# EAGLE design rj12_adapter (EAGLE 8.5.0)
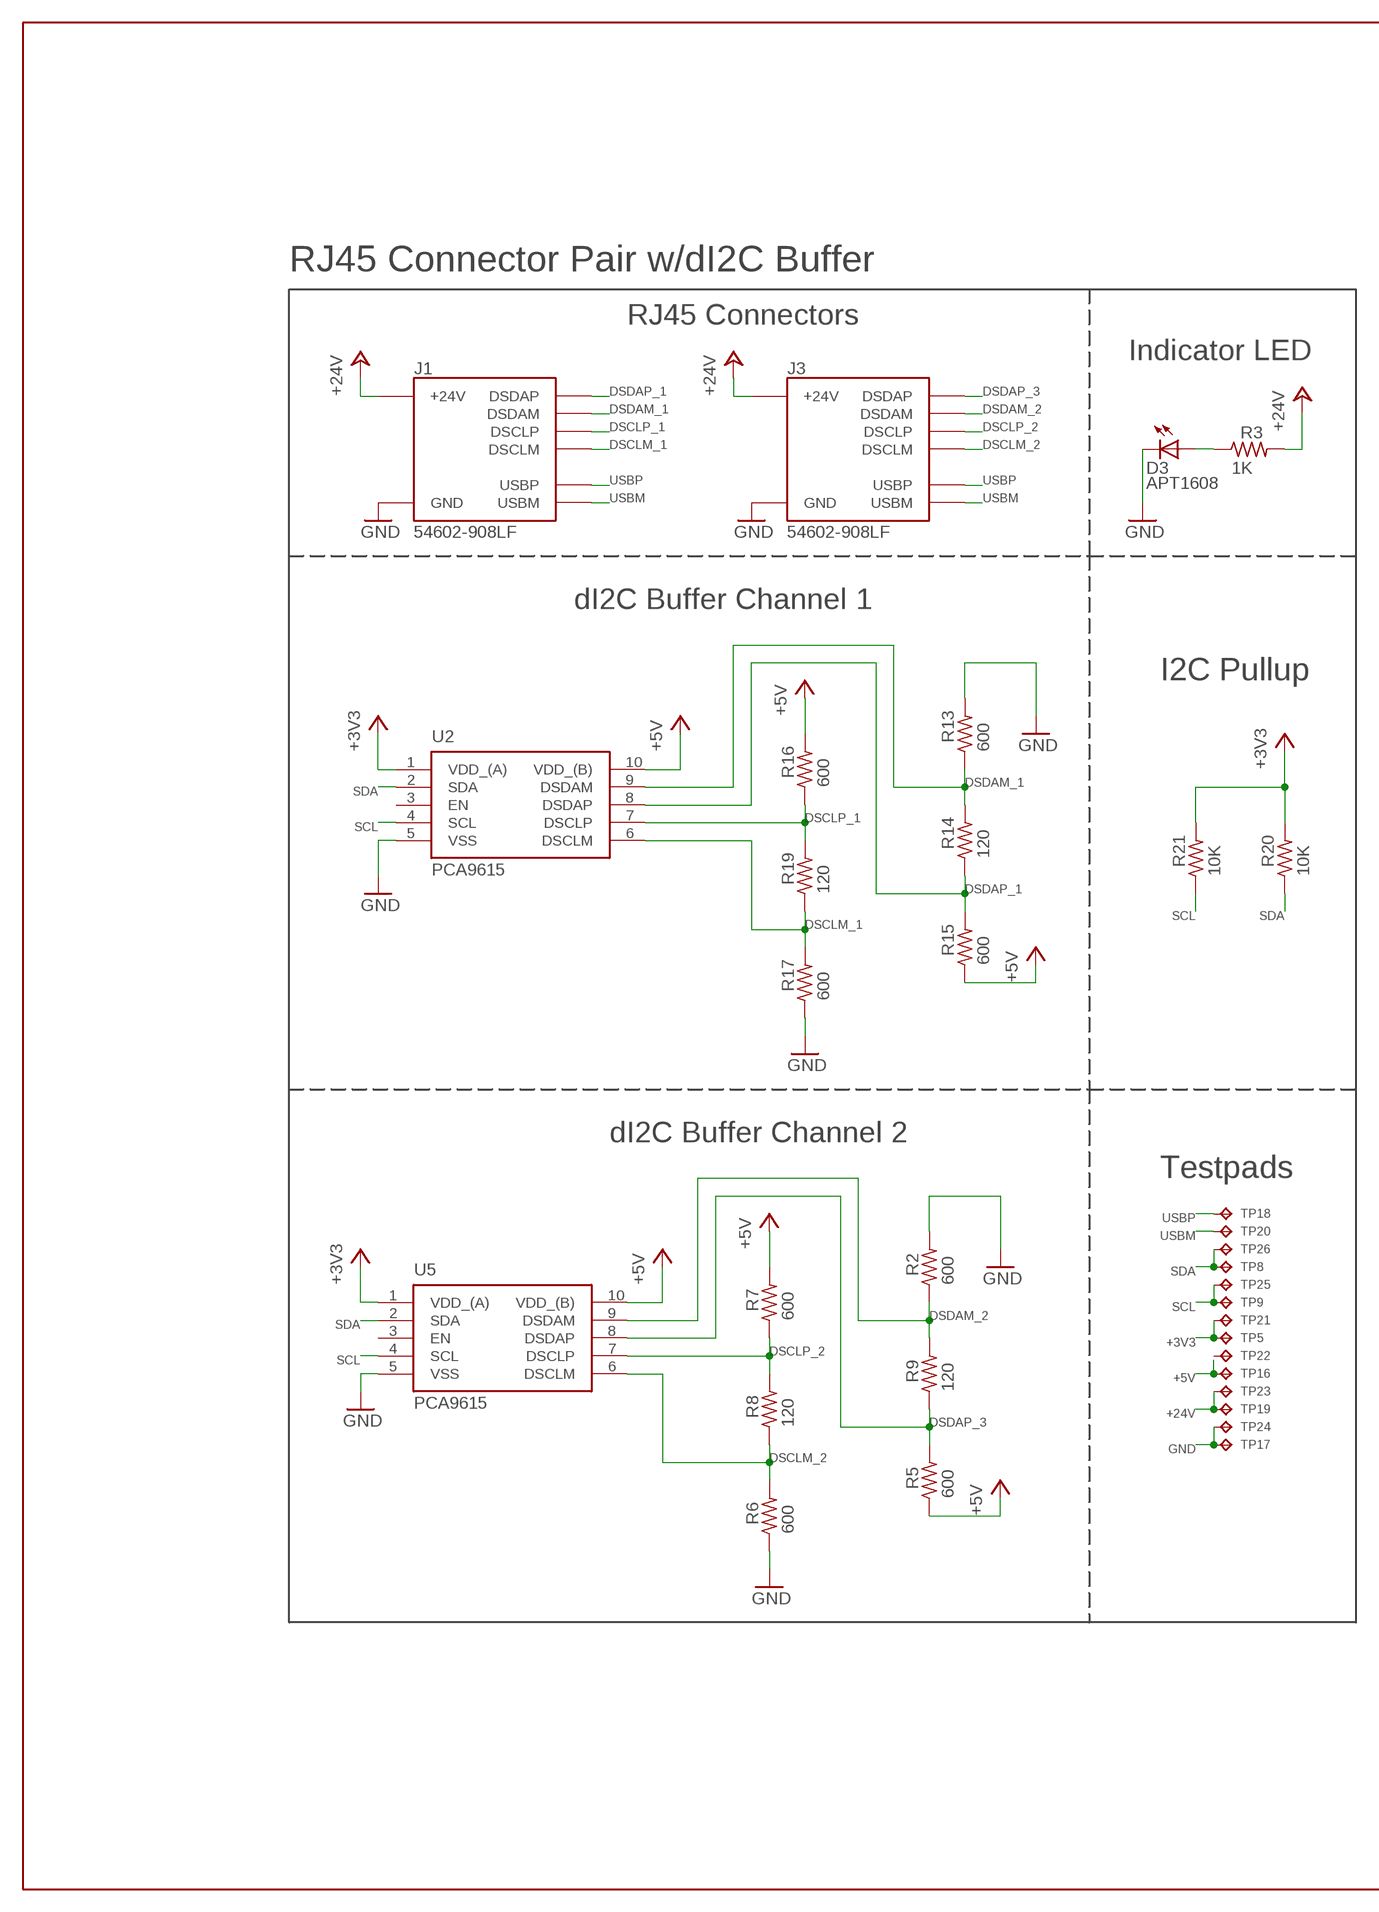
[diagram p0: schematic, sheet 1, part 1 of 2]
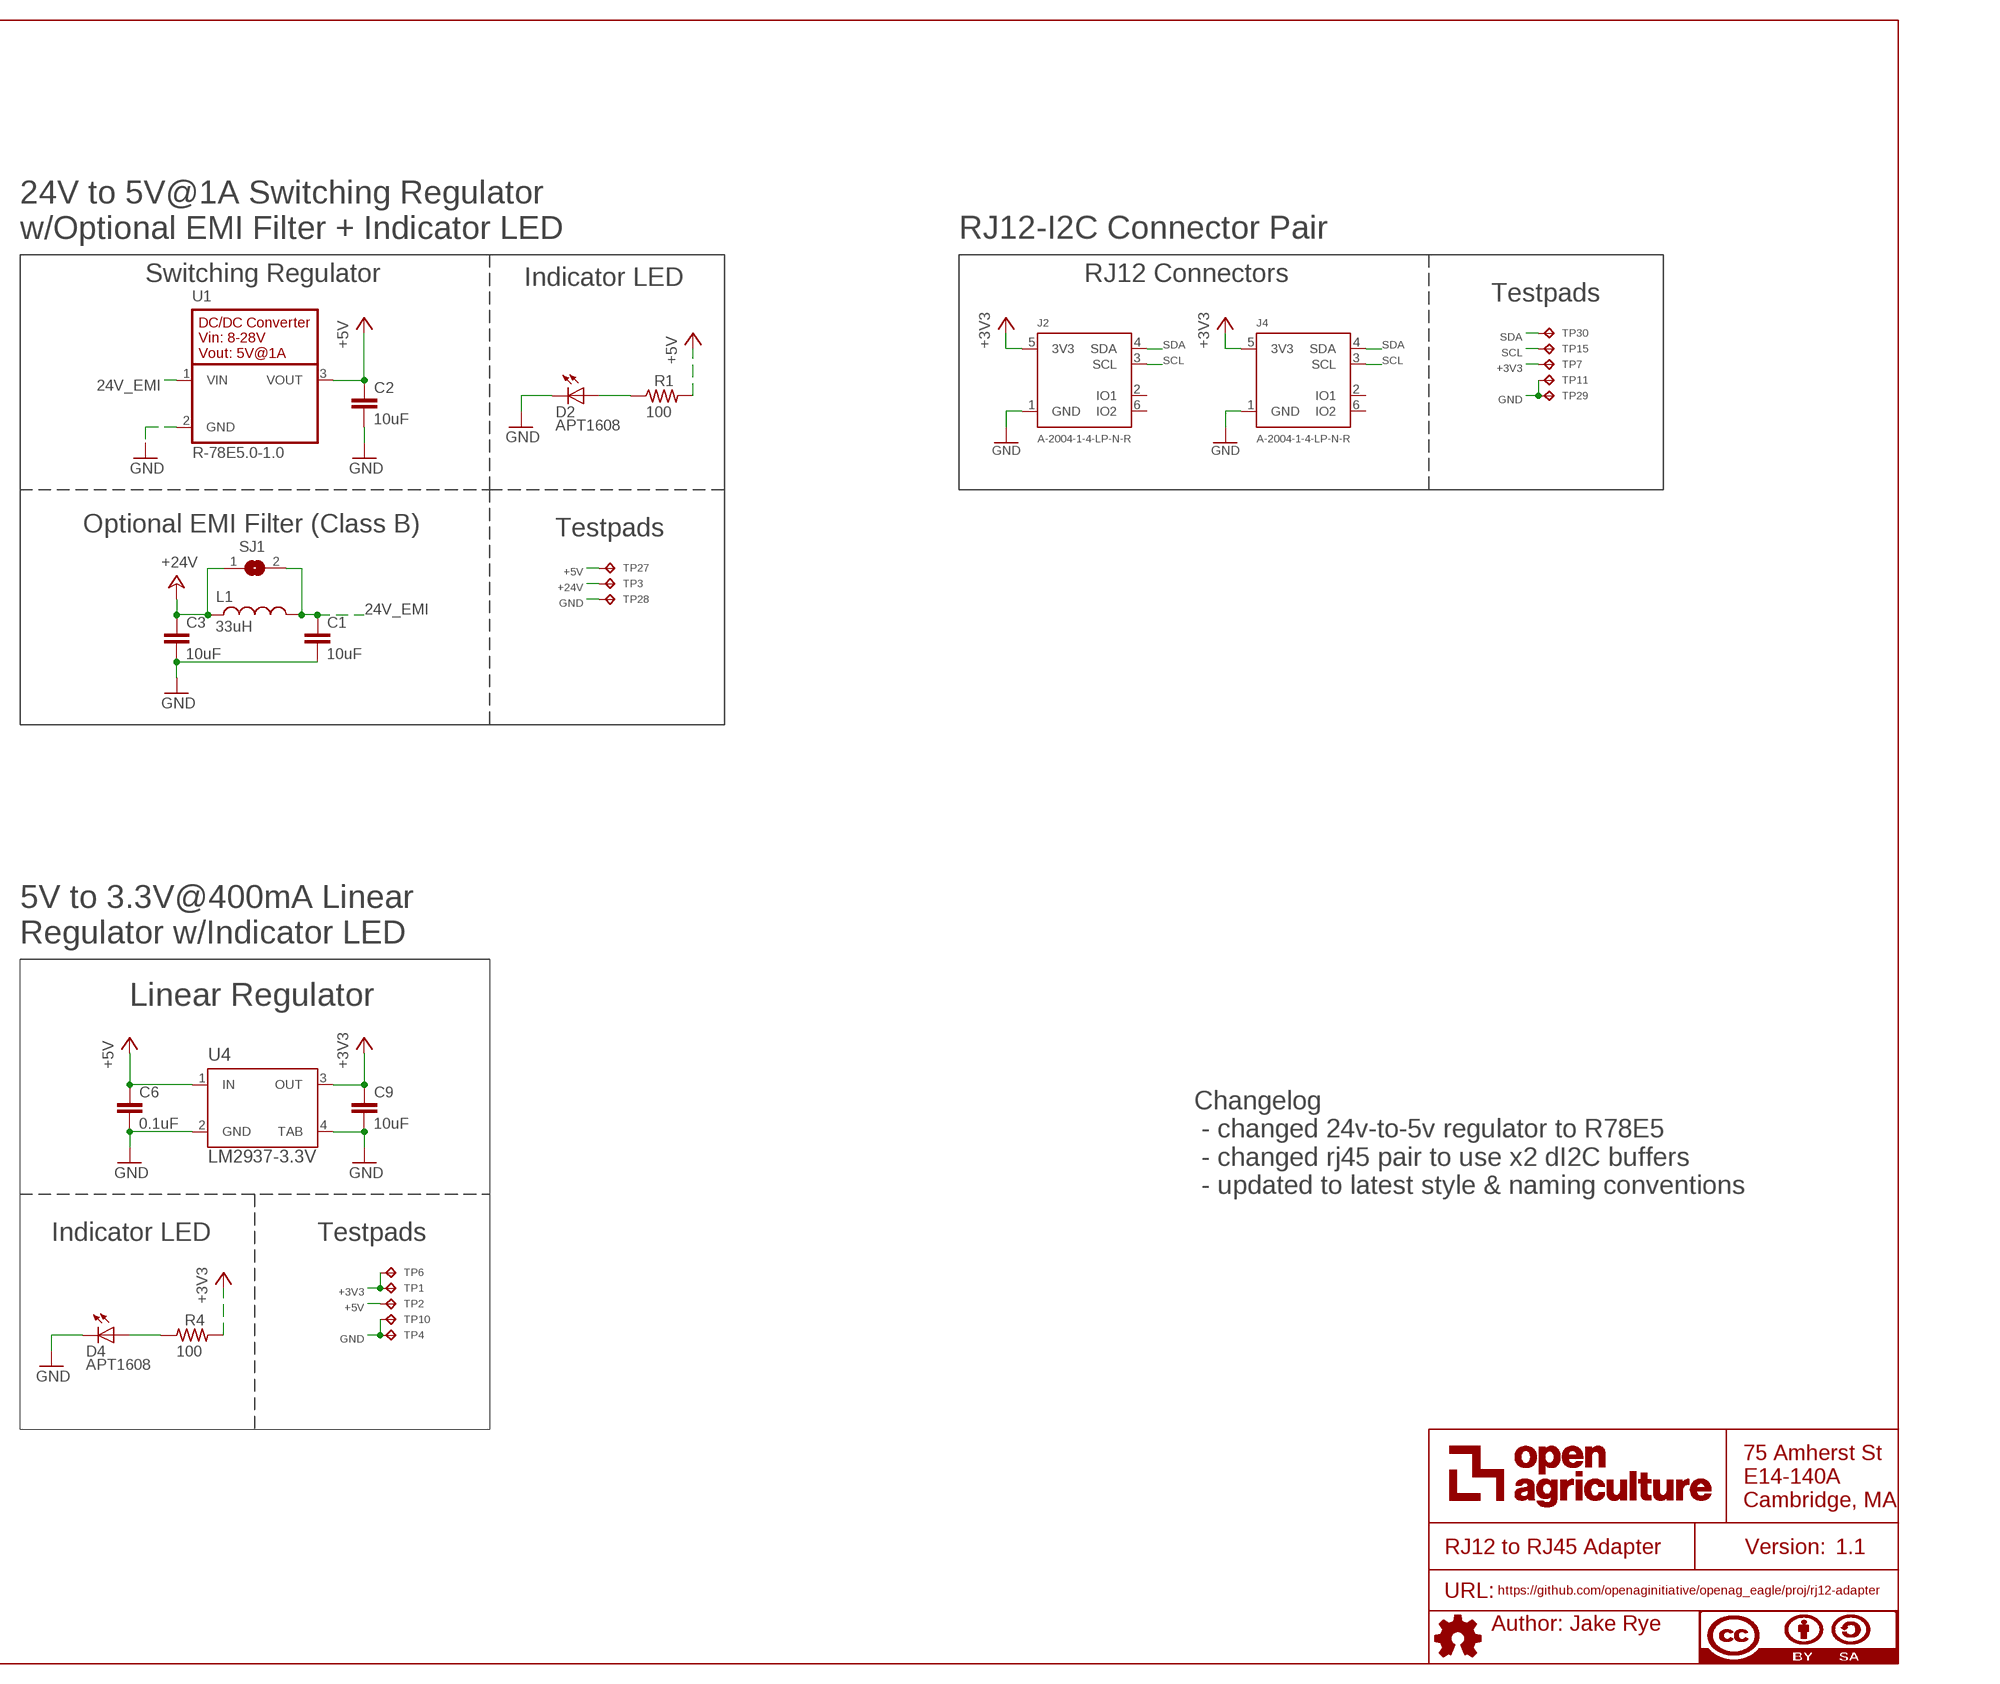
[diagram p1: schematic, sheet 1, part 2 of 2]

## Parts
C1  10uF  10UF-GMK212BBJ106KG-T  [C0805]
C2  10uF  10UF-GMK212BBJ106KG-T  [C0805]
C3  10uF  10UF-GMK212BBJ106KG-T  [C0805]
C6  0.1uF  0.1UF-C0603C104K5RACTU  [C0603]
C9  10uF  10UF-GMK212BBJ106KG-T  [C0805]
D2  APT1608  APT1608CGCK  [CHIPLED_0603]
D3  APT1608  APT1608CGCK  [CHIPLED_0603]
D4  APT1608  APT1608CGCK  [CHIPLED_0603]
J1  54602-908LF  RJ45-DI2C-USB-54602-908LFPTH  [RJ45-DI2C-USB-54602-908LF]
J2  A-2004-1-4-LP-N-R  RJ12-I2C-A-2004-1-4-LP-N-R  [RJ12-I2C-A-2004-1-4-LP-N-R]
J3  54602-908LF  RJ45-DI2C-USB-54602-908LFPTH  [RJ45-DI2C-USB-54602-908LF]
J4  A-2004-1-4-LP-N-R  RJ12-I2C-A-2004-1-4-LP-N-R  [RJ12-I2C-A-2004-1-4-LP-N-R]
L1  33uH  33UH-29333C  [29333C]
R1  100  100OHM-RC0603JR-07100RL  [RC0603N]
R2  600  600OHM-RC0603FR-07604RL  [RC0603N]
R3  1K  1K-ERJ-PB3D1001V  [RC0603N]
R4  100  100OHM-RC0603JR-07100RL  [RC0603N]
R5  600  600OHM-RC0603FR-07604RL  [RC0603N]
R6  600  600OHM-RC0603FR-07604RL  [RC0603N]
R7  600  600OHM-RC0603FR-07604RL  [RC0603N]
R8  120  120OHM-RC0603FR-07120RL  [RC0603N]
R9  120  120OHM-RC0603FR-07120RL  [RC0603N]
R13  600  600OHM-RC0603FR-07604RL  [RC0603N]
R14  120  120OHM-RC0603FR-07120RL  [RC0603N]
R15  600  600OHM-RC0603FR-07604RL  [RC0603N]
R16  600  600OHM-RC0603FR-07604RL  [RC0603N]
R17  600  600OHM-RC0603FR-07604RL  [RC0603N]
R19  120  120OHM-RC0603FR-07120RL  [RC0603N]
R20  10K  10K-ERJ-3EKF1002V  [RC0603N]
R21  10K  10K-ERJ-3EKF1002V  [RC0603N]
SJ1  SOLDERJUMPERREFLOW_NOPASTE  [SJ1]
TP1  TPTP04R  [TP04R]
TP2  TPTP04R  [TP04R]
TP3  TPTP06R  [TP06R]
TP4  TPTP04R  [TP04R]
TP5  TPTP04R  [TP04R]
TP6  TPTP04R  [TP04R]
TP7  TPTP04R  [TP04R]
TP8  TPTP04R  [TP04R]
TP9  TPTP04R  [TP04R]
TP10  TPTP04R  [TP04R]
TP11  TPTP04R  [TP04R]
TP15  TPTP04R  [TP04R]
TP16  TPTP04R  [TP04R]
TP17  TPTP04R  [TP04R]
TP18  TPTP04R  [TP04R]
TP19  TPTP04R  [TP04R]
TP20  TPTP04R  [TP04R]
TP21  TPTP04R  [TP04R]
TP22  TPTP04R  [TP04R]
TP23  TPTP04R  [TP04R]
TP24  TPTP04R  [TP04R]
TP25  TPTP04R  [TP04R]
TP26  TPTP04R  [TP04R]
TP27  TPTP06R  [TP06R]
TP28  TPTP06R  [TP06R]
TP29  TPTP04R  [TP04R]
TP30  TPTP04R  [TP04R]
U1  R-78E5.0-1.0  [R-78E5.0-1.0]
U2  PCA9615  PCA9615DPJ  [SOP50P490X110-10N]
U4  LM2937-3.3V  LM2937IMP-3.3/NOPB  [MP04A]
U5  PCA9615  PCA9615DPJ  [SOP50P490X110-10N]
U$6  AUTHOR  [AUTHOR]
U$7  TITLE  [TITLE]

## Nets
24V_EMI: C1.1 L1.2 SJ1.2 U1.1(VIN)
+3V3: C9.1 J2.5(3V3) J4.5(3V3) R4.2 R20.2 R21.2 TP1.1(TP) TP5.1(TP) TP6.1(TP) TP7.1(TP) TP21.1(TP) U2.1(VDD_(A)) U4.3(OUT) U5.1(VDD_(A))
+5V: C2.1 C6.1 R1.2 R5.1 R7.2 R15.1 R16.2 TP2.1(TP) TP16.1(TP) TP22.1(TP) TP27.TP U1.3(VOUT) U2.10(VDD_(B)) U4.1(IN) U5.10(VDD_(B))
+24V: C3.1 J1.24V(6)(+24V) J3.24V(6)(+24V) L1.1 R3.2 SJ1.1 TP3.TP TP19.1(TP) TP23.1(TP)
DSCLM_1: J1.DSCLM(5)(DSCLM) R17.2 R19.1 U2.6(DSCLM)
DSCLM_2: J3.DSCLM(5)(DSCLM) R6.2 R8.1 U5.6(DSCLM)
DSCLP_1: J1.DSCLP(4)(DSCLP) R16.1 R19.2 U2.7(DSCLP)
DSCLP_2: J3.DSCLP(4)(DSCLP) R7.1 R8.2 U5.7(DSCLP)
DSDAM_1: J1.DSDAM(2)(DSDAM) R13.1 R14.2 U2.9(DSDAM)
DSDAM_2: J3.DSDAM(2)(DSDAM) R2.1 R9.2 U5.9(DSDAM)
DSDAP_1: J1.DSDAP(1)(DSDAP) R14.1 R15.2 U2.8(DSDAP)
DSDAP_3: J3.DSDAP(1)(DSDAP) R5.2 R9.1 U5.8(DSDAP)
GND: C1.2 C2.2 C3.2 C6.2 C9.2 D2.C D3.C D4.C J1.GND(3)(GND) J2.1(GND) J3.GND(3)(GND) J4.1(GND) R2.2 R6.1 R13.2 R17.1 TP4.1(TP) TP10.1(TP) TP11.1(TP) TP17.1(TP) TP24.1(TP) TP28.TP TP29.1(TP) U1.2(GND) U2.5(VSS) U4.2(GND) U4.4(TAB) U5.5(VSS)
N$5: D4.A R4.1
N$6: D2.A R1.1
N$7: D3.A R3.1
SCL: J2.3(SCL) J4.3(SCL) R21.1 TP9.1(TP) TP15.1(TP) TP25.1(TP) U2.4(SCL) U5.4(SCL)
SDA: J2.4(SDA) J4.4(SDA) R20.1 TP8.1(TP) TP26.1(TP) TP30.1(TP) U2.2(SDA) U5.2(SDA)
USBM: J1.USBM(8)(USBM) J3.USBM(8)(USBM) TP20.1(TP)
USBP: J1.USBP(7)(USBP) J3.USBP(7)(USBP) TP18.1(TP)
Unconnected: J2.2(IO1) J2.6(IO2) J4.2(IO1) J4.6(IO2) U2.3(EN) U5.3(EN)

## Notes on the sheet
- RJ45 Connector Pair w/dI2C Buffer
- 24V to 5V@1A Switching Regulator
  w/Optional EMI Filter + Indicator LED
- RJ12-I2C Connector Pair
- RJ45 Connectors | Switching Regulator | Indicator LED | RJ12 Connectors
- Testpads
- Indicator LED
- dI2C Buffer Channel 1 | Optional EMI Filter (Class B) | Testpads
- I2C Pullup
- 5V to 3.3V@400mA Linear 
  Regulator w/Indicator LED
- dI2C Buffer Channel 2 | Linear Regulator
- Testpads
- Changelog
   - changed 24v-to-5v regulator to R78E5
   - changed rj45 pair to use x2 dI2C buffers
   - updated to latest style & naming conventions
- Indicator LED | Testpads

## Library data of the parts
C1-C3 C9 = openag-capacitors:10UF-GMK212BBJ106KG-T: CAP CER 10UF 35V X5R 0805 Description: 10µF ±10% 35V Ceramic Capacitor X5R 0805 (2012 Metric) Technical Specifications: Capacitance: 10µF Tolerance: ±10% Rated Voltage: 35V Temperature Coefficient: X5R Operating Temperature: -55°C ~ 85°C Package / Case: 0805 (2012 Metric) Datasheet(s): GMK212BBJ106KG-T Spec <http://ds.yuden.co.jp/TYCOMPAS/ut/detail.do?productNo=GMK212BBJ106KG-T&fileName=GMK212BBJ106KG-T_SS&mode=specSheetDownload> Vendor(s): Digikey: 587-4893-1-ND <https://www.digikey.com/product-detail/en/taiyo-yuden/GMK212BBJ106KG-T/587-4893-1-ND/6563736>; MANUFACTURER: Taiyo Yuden; MPN: GMK212BBJ106KG-T; VENDOR: Digikey; VLINK: https://www.digikey.com/product-detail/en/taiyo-yuden/GMK212BBJ106KG-T/587-4893-1-ND/6563736; VPN: 587-4893-1-ND
C6 = openag-capacitors:0.1UF-C0603C104K5RACTU: CAP CER 0.1UF 50V X7R 0603 Description: 0.1µF ±10% 50V Ceramic Capacitor X7R 0603 (1608 Metric) Technical Specifications: Capacitance: 0.1µF Tolerance: ±10% Rated Voltage: 50V Temperature Coefficient: X7R Operating Temperature: -55°C ~ 125°C Package / Case: 0603 (1608 Metric) Datasheet(s): X7R Dielectric, 6.3-250 VDC <https://search.kemet.com/component-edge/download/datasheet/C0603C104K5RACTU.pdf> Vendor(s): Digikey: 399-5089-1-ND <https://www.digikey.com/product-detail/en/kemet/C0603C104K5RACTU/399-5089-1-ND/1465623>; MANUFACTURER: Kemet; MPN: C0603C104K5RACTU; VENDOR: Digikey; VLINK: https://www.digikey.com/product-detail/en/kemet/C0603C104K5RACTU/399-5089-1-ND/1465623; VPN: 399-5089-1-ND
D2-D4 = openag-diodes:APT1608CGCK: LED GREEN CLEAR 0603 SMD Description: Green 570nm LED Indication - Discrete 2.1V 0603 (1608 Metric) Technical Specifications: Color: Green Lens Color: Colorless Lens Transparency: Clear Millicandela Rating: 50mcd Lens Style/Size: Rectangle with Flat Top, 1.20mm x 0.80mm Voltage - Forward (Vf) (Typ): 2.1V Current - Test: 20mA Viewing Angle: 120° Mounting Type: Surface Mount Wavelength - Dominant: 570nm Wavelength - Peak: 574nm Package / Case: 0603 (1608 Metric) Supplier Device Package: Chip LED Size / Dimension: 1.60mm L x 0.80mm W Height (Max): 0.75mm Datasheet(s): APT1608CGCK <http://www.kingbrightusa.com/images/catalog/SPEC/APT1608CGCK.pdf> Vendor(s): Digikey: 754-1116-1-ND <https://www.digikey.com/product-detail/en/kingbright/APT1608CGCK/754-1116-1-ND/1747833#>; MANUFACTURER: Kingbright; MPN: APT1608CGCK; VENDOR: Digikey; VLINK: https://www.digikey.com/product-detail/en/kingbright/APT1608CGCK/754-1116-1-ND/1747833#; VPN: 754-1116-1-ND
J1 J3 = openag-connectors:RJ45-DI2C-USB-54602-908LF: CONN MOD JACK 8P8C R/A UNSHLD Description: Jack Modular Connector 8p8c (RJ45, Ethernet) 90° Angle (Right) Unshielded Cat3 Technical Specifications: Connector Type: Jack Number of Positions/Contacts: 8p8c (RJ45, Ethernet) Number of Ports: 1 Number of Rows: 1 Mounting Type: Through Hole Orientation: 90° Angle (Right) Termination: Solder Shielding: Unshielded Ratings: Cat3 Features: Board Lock LED Color: Does Not Contain LED Tab Direction: Down Contact Material: Copper Alloy Contact Finish: Gold Contact Finish Thickness: 15µin (0.38µm) Housing Material: Polyester, Glass Filled Operating Temperature: -40°C ~ 70°C Datasheet(s): 54601-x04(zzz)WPLF Drawing <http://cdn.amphenol-icc.com/media/wysiwyg/files/drawing/c-bmj-0102.pdf> Vendor(s): Digikey: 609-1046-ND <https://www.digikey.com/product-detail/en/amphenol-fci/54602-908LF/609-1046-ND/1001360>; MANUFACTURER: Amphenol FCI; MPN: 54602-908LF; VENDOR: Digikey; VLINK: https://www.digikey.com/product-detail/en/amphenol-fci/54602-908LF/609-1046-ND/1001360; VPN: 609-1046-ND
J2 J4 = openag-connectors:RJ12-I2C-A-2004-1-4-LP-N-R: CONN MOD JACK 6P6C R/A UNSHLD Description: Jack Modular Connector 6p6c (RJ11, RJ12, RJ14, RJ25) 90° Angle (Right) Unshielded Technical Specifications: Connector Type: Jack Number of Positions/Contacts: 6p6c (RJ11, RJ12, RJ14, RJ25) Number of Ports: 1 Number of Rows: 1 Mounting Type: Through Hole Orientation: 90° Angle (Right) Termination: Solder Shielding: Unshielded Features: Board Lock LED Color: Does Not Contain LED Tab Direction: Down Contact Material: Phosphor Bronze Contact Finish: Gold Contact Finish Thickness: 6µin (0.152µm) Housing Material: Polybutylene Terephthalate (PBT), Glass Filled Operating Temperature: -40°C ~ 85°C Datasheet(s): A-2004-1-4-LP-N Drawing <http://www.assmann-wsw.com/fileadmin/datasheets/ASS_7320_CO.pdf> Vendor(s): Digikey: AE10383-ND <https://www.digikey.com/product-detail/en/assmann-wsw-components/A-2004-1-4-LP-N-R/AE10383-ND/2183634>; MANUFACTURER: Assmann WSW Components; MPN: A-2004-1-4-LP-N-R; VENDOR: Digikey; VLINK: https://www.digikey.com/product-detail/en/assmann-wsw-components/A-2004-1-4-LP-N-R/AE10383-ND/2183634; VPN: AE10383-ND
L1 = openag-inductors:33UH-29333C: FIXED IND 33UH 1A 120 MOHM SMD Description: 33µH Shielded Wirewound Inductor 1A 120 mOhm Max Nonstandard Technical Specifications: Type: Wirewound Inductance: 33µH Current Rating: 1A Shielding: Shielded DC Resistance (DCR): 120 mOhm Max Operating Temperature: -40°C ~ 85°C Frequency - Test: 10kHz Mounting Type: Surface Mount Package / Case: Nonstandard Size / Dimension: 0.283" L x 0.283" W (7.20mm x 7.20mm) Height - Seated (Max): 0.157" (4.00mm) Datasheet(s): 2900 Series <https://www.murata-ps.com/data/magnetics/kmp_2900.pdf> Vendor(s): Digikey: 811-1138-1-ND <https://www.digikey.com/product-detail/en/murata-power-solutions-inc/29333C/811-1138-1-ND/1924860>; MANUFACTURER: Murata Power Solutions Inc.; MPN: 29333C; VENDOR: Digikey; VLINK: https://www.digikey.com/product-detail/en/murata-power-solutions-inc/29333C/811-1138-1-ND/1924860; VPN: 811-1138-1-ND
R1 R4 = openag-resistors:100OHM-RC0603JR-07100RL: RES SMD 100 OHM 5% 1/10W 0603 Description: 100 Ohms ±5% 0.1W, 1/10W Chip Resistor 0603 (1608 Metric) Moisture Resistant Thick Film Technical Specifications: Resistance: 100 Ohms Tolerance: ±5% Power (Watts): 0.1W, 1/10W Composition: Thick Film Features: Moisture Resistant Temperature Coefficient: ±100ppm/°C Operating Temperature: -55°C ~ 155°C Package / Case: 0603 (1608 Metric) Supplier Device Package: 0603 Size / Dimension: 0.063" L x 0.032" W (1.60mm x 0.80mm) Height - Seated (Max): 0.022" (0.55mm) Number of Terminations: 2 Datasheet(s): Thick Film Chip Resistor Intro <http://www.yageo.com.tw/exep/pages/download/literatures/PYu-R_INT-thick_7.pdf> Chip Resistor Marking <http://www.yageo.com/exep/pages/download/literatures/PYu-R_Marking_2.pdf> RC Series, L Datasheet <http://www.yageo.com/documents/recent/PYu-RC_Group_51_RoHS_L_8.pdf> Vendor(s): Digikey: 311-100GRCT-ND <https://www.digikey.com/product-detail/en/yageo/RC0603JR-07100RL/311-100GRCT-ND/729644>; MANUFACTURER: Yageo; MPN: RC0603JR-07100RL; VENDOR: Digikey; VLINK: https://www.digikey.com/product-detail/en/yageo/RC0603JR-07100RL/311-100GRCT-ND/729644; VPN: 311-100GRCT-ND
R2 R5-R7 R13 R15-R17 = openag-resistors:600OHM-RC0603FR-07604RL: RES SMD 604 OHM 1% 1/10W 0603 Description: 604 Ohms ±1% 0.1W, 1/10W Chip Resistor 0603 (1608 Metric) Moisture Resistant Thick Film Technical Specifications: Resistance: 604 Ohms Tolerance: ±1% Power (Watts): 0.1W, 1/10W Composition: Thick Film Features: Moisture Resistant Temperature Coefficient: ±100ppm/°C Operating Temperature: -55°C ~ 155°C Package / Case: 0603 (1608 Metric) Supplier Device Package: 0603 Size / Dimension: 0.063" L x 0.032" W (1.60mm x 0.80mm) Height - Seated (Max): 0.022" (0.55mm) Number of Terminations: 2 Datasheet(s): RC Series, L Datasheet <http://www.yageo.com/documents/recent/PYu-RC_Group_51_RoHS_L_8.pdf> Chip Resistor Marking <http://www.yageo.com/exep/pages/download/literatures/PYu-R_Marking_2.pdf> Vendor(s): Digikey: 311-604HRCT-ND <https://www.digikey.com/product-detail/en/yageo/RC0603FR-07604RL/311-604HRCT-ND/730276>; MANUFACTURER: Yageo; MPN: RC0603FR-07604RL; VENDOR: Digikey; VLINK: https://www.digikey.com/product-detail/en/yageo/RC0603FR-07604RL/311-604HRCT-ND/730276; VPN: 311-604HRCT-ND
R3 = openag-resistors:1K-ERJ-PB3D1001V: RES SMD 1K OHM 0.5% 1/5W 0603 Description: 1 kOhms ±0.5% 0.2W, 1/5W Chip Resistor 0603 (1608 Metric) Automotive AEC-Q200, Pulse Withstanding Thick Film Technical Specifications: Resistance: 1 kOhms Tolerance: ±0.5% Power: 0.2W, 1/5W Operating Temperature: -55°C ~ 155°C Package / Case: 0603 (1608 Metric) Datasheet(s): ERJ-PB3, PB6 Series, High Precision Datasheet <https://industrial.panasonic.com/cdbs/www-data/pdf/RDM0000/AOA0000C328.pdf> Vendor(s): Digikey: P20283CT-ND <https://www.digikey.com/product-detail/en/panasonic-electronic-components/ERJ-PB3D1001V/P20283CT-ND/6214538>; MANUFACTURER: Panasonic; MPN: P20283CT-ND; VENDOR: Digikey; VLINK: https://www.digikey.com/product-detail/en/panasonic-electronic-components/ERJ-PB3D1001V/P20283CT-ND/6214538; VPN: P20283CT-ND
R8 R9 R14 R19 = openag-resistors:120OHM-RC0603FR-07120RL: RES SMD 120 OHM 1% 1/10W 0603 Description: 120 Ohms ±1% 0.1W, 1/10W Chip Resistor 0603 (1608 Metric) Moisture Resistant Thick Film Technical Specifications: Resistance: 120 Ohms Tolerance: ±1% Power (Watts): 0.1W, 1/10W Composition: Thick Film Features: Moisture Resistant Temperature Coefficient: ±100ppm/°C Operating Temperature: -55°C ~ 155°C Package / Case: 0603 (1608 Metric) Supplier Device Package: 0603 Size / Dimension: 0.063" L x 0.032" W (1.60mm x 0.80mm) Height - Seated (Max): 0.022" (0.55mm) Number of Terminations: 2 Datasheet(s): RC Series, L Datasheet <http://www.yageo.com/documents/recent/PYu-RC_Group_51_RoHS_L_8.pdf> Chip Resistor Marking <http://www.yageo.com/exep/pages/download/literatures/PYu-R_Marking_2.pdf> Vendor(s): Digikey: 311-120HRCT-ND <https://www.digikey.com/product-detail/en/yageo/RC0603FR-07120RL/311-120HRCT-ND/729867>; MANUFACTURER: Yageo; MPN: RC0603FR-07120RL; VENDOR: Digikey; VLINK: https://www.digikey.com/product-detail/en/yageo/RC0603FR-07120RL/311-120HRCT-ND/729867; VPN: 311-120HRCT-ND
R20 R21 = openag-resistors:10K-ERJ-3EKF1002V: RES SMD 10K OHM 1% 1/10W 0603 Description: 10 kOhms ±1% 0.1W, 1/10W Chip Resistor 0603 (1608 Metric) Automotive AEC-Q200 Thick Film Technical Specifications: Resistance: 10kOhms Tolerance: ±1% Power: 0.1W, 1/10W Operating Temperature: -55°C ~ 155°C Package/Case: 0603 (1608 Metric) Datasheet(s): ERJ-3EKF1002V View All Specifications <https://industrial.panasonic.com/ww/products/resistors/chip-resistors/general-purpose-chip-resistors/precision-thick-film-chip-resistors/ERJ3EKF1002V> Vendor(s): Digikey: P10.0KHCT-ND <https://www.digikey.com/product-detail/en/panasonic-electronic-components/ERJ-3EKF1002V/P10.0KHCT-ND/198102>; MANUFACTURER: Panasonic; MPN: ERJ-3EKF1002V; VENDOR: Digikey; VLINK: https://www.digikey.com/product-detail/en/panasonic-electronic-components/ERJ-3EKF1002V/P10.0KHCT-ND/198102; VPN: P10.0KHCT-ND
SJ1 = openag-connectors:SOLDERJUMPER: SMD Solder JUMPER Solder the two pads together to create a connection, or remove the solder to break it. REFLOW - Use this footprint for solder paste and reflow ovens. WAVE - Use this footprint for hand-soldering (larger pads). CLOSED - Has a trace between the two pads to ensure it is closed by default. The trace needs to be cut to disable the jumper, and can be closed again by creating a solder bridge between the two pads.; MPN: N/A
TP1-TP11 TP15-TP30 = openag-testpads:TP: Test pad; MPN: N/A
U1 = openag-regulators:R-78E5.0-1.0: DC/DC CONVERTER 5V 5W Description: Linear Regulator Replacement DC DC Converter 1 Output 5V 1A 8V - 28V Input Technical Specifications: Type: Linear Regulator Replacement Number of Outputs: 1 Voltage - Input (Min): 8V Voltage - Input (Max): 28V Voltage - Output 1: 5V Current - Output (Max): 1A Power (Watts): 5W Applications: ITE (Commercial) Features: SCP Operating Temperature: -40°C ~ 85°C Efficiency: 91% Mounting Type: Through Hole Package / Case: 3-SIP Module Size / Dimension: 0.46" L x 0.33" W x 0.41" H (11.6mm x 8.5mm x 10.4mm) Datasheet(s): R-78E-1.0 Series Datasheet <https://www.recom-power.com/pdf/Innoline/R-78Exx-1.0.pdf> Vendor(s): Digikey: 945-2201-ND <https://www.digikey.com/product-detail/en/recom-power/R-78E5.0-1.0/945-2201-ND/4930585>; MANUFACTURER: Recom Power; MPN: R-78E5.0-1.0; VENDOR: Digikey; VLINK: https://www.digikey.com/product-detail/en/recom-power/R-78E5.0-1.0/945-2201-ND/4930585; VPN: 945-2201-ND
U2 U5 = openag-buffers:PCA9615DPJ: IC REDRIVER I2C 2CH 10TSSOP Description: Buffer, ReDriver 2 Channel 400kHz 10-TSSOP Technical Specifications: Type: Buffer, ReDriver Applications: I²C Input: 2-Wire Bus Output: 2-Wire Bus Data Rate (Max): 400kHz Number of Channels: 2 Capacitance - Input: 7pF Voltage - Supply: 2.3 V ~ 5.5 V Current - Supply: 16µA Operating Temperature: -40°C ~ 85°C Package / Case: 10-TFSOP, 10-MSOP (0.118", 3.00mm Width) Supplier Device Package: 10-TSSOP Base Part Number: PCA9615 Datasheet(s): PCA9615DP <http://www.nxp.com/documents/data_sheet/PCA9615.pdf> Vendor(s): Digikey: 568-11484-1-ND <https://www.digikey.com/product-detail/en/nxp-usa-inc/PCA9615DPJ/568-11484-1-ND/4864508>; MANUFACTURER: NXP USA Inc.; MPN: PCA9615DPJ; VENDOR: Digikey; VLINK: https://www.digikey.com/product-detail/en/nxp-usa-inc/PCA9615DPJ/568-11484-1-ND/4864508; VPN: 568-11484-1-ND
U4 = openag-regulators:LM2937IMP-3.3/NOPB: IC REG LIN 3.3V 400MA SOT223-4 Description: Linear Voltage Regulator IC Positive Fixed 1 Output 3.3V 400mA SOT-223-4 Technical Specifications: Output Configuration: Positive Output Type: Fixed Number of Regulators: 1 Voltage - Input (Max): 26V Voltage - Output (Min/Fixed): 3.3V Voltage Dropout (Max): 1V @ 50mA Current - Output: 400mA Current - Quiescent (Iq): 2mA Current - Supply (Max): 1.25A Protection Features: Over Temperature, Reverse Polarity, Short Circuit Operating Temperature: -40°C ~ 85°C Mounting Type: Surface Mount Package / Case: TO-261-4, TO-261AA Supplier Device Package: SOT-223-4 Base Part Number: LM2937 Datasheet(s): LM2937-2.5, LM2937-3.3 Datasheet <http://www.ti.com/lit/ds/symlink/lm2937-2.5.pdf> Vendor(s): Digikey: LM2937IMP-3.3/NOPBCT-ND <https://www.digikey.com/product-detail/en/texas-instruments/LM2937IMP-3.3-NOPB/LM2937IMP-3.3-NOPBCT-ND/270742#>; MANUFACTURER: Texas Instruments; MPN: LM2937IMP-3.3/NOPB; VENDOR: Digikey; VLINK: https://www.digikey.com/product-detail/en/texas-instruments/LM2937IMP-3.3-NOPB/LM2937IMP-3.3-NOPBCT-ND/270742#; VPN: LM2937IMP-3.3/NOPBCT-ND
U$6 = openag-frames:AUTHOR; AUTHOR: Jake Rye; MPN: N/A
U$7 = openag-frames:TITLE; MPN: N/A; TITLE: RJ12 to RJ45 Adapter; URL: https://github.com/openaginitiative/openag_eagle/proj/rj12-adapter; VER: 1.1

## Board
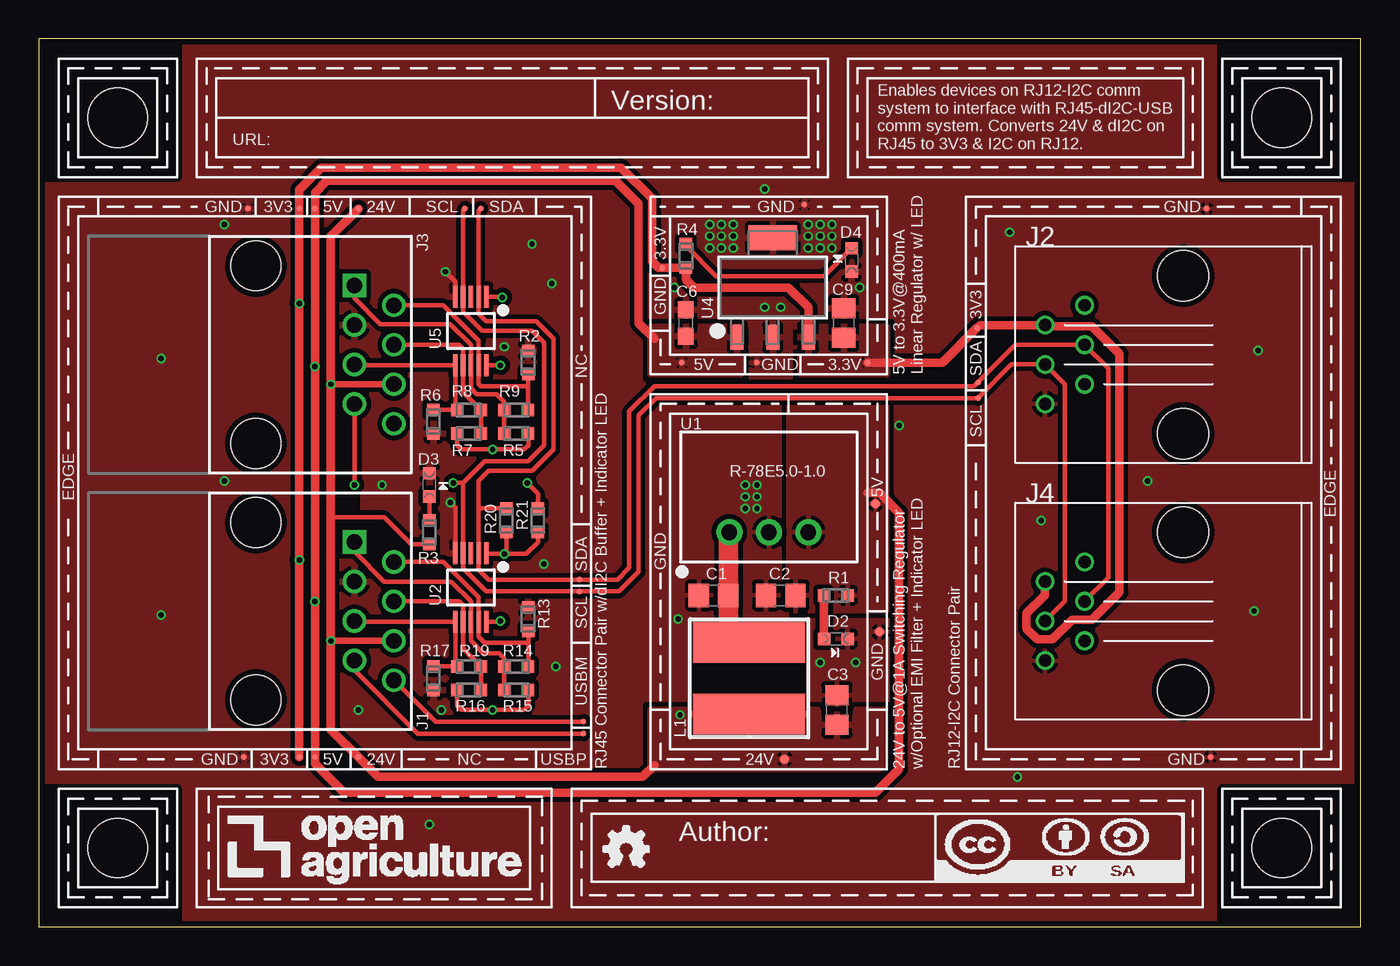
[diagram p2: board, top side]
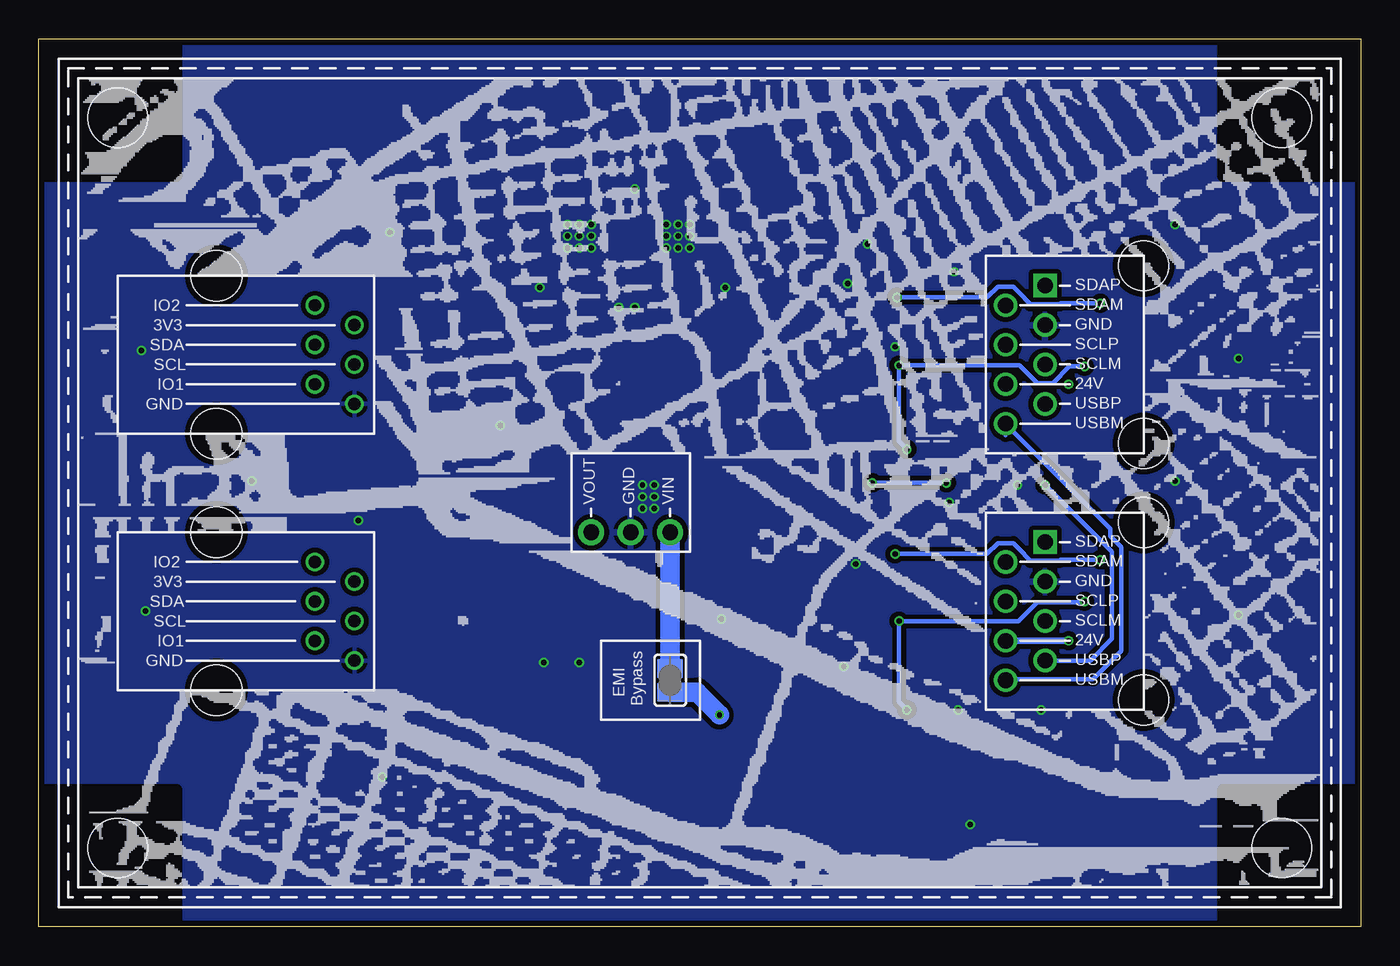
[diagram p3: board, bottom side, seen from below]

Size 85.09 x 57.15 mm. Coordinates in mm from the lower left corner, seen from the top.
Outline: 0,0 85.09,0 85.09,57.15 0,57.15 0,0
Copper layers (1*16): Top 0.035559375mm / dielectric 1.6mm / Bottom 0.035559375mm
Design rules "oshpark-2layer-mask": minimum track width 6mil, minimum drill 10mil, track to track 6mil, track to pad 6mil, pad to pad 6mil, via to via 6mil, smd to smd 6mil, copper to edge 15mil, drill to drill 6mil, minimum pad ring 5mil, minimum via ring 5mil, stop-mask expansion 2.5mil, vias tented up to drill 20mil, thermal gap 10mil
tRestrict: 3 lines

### Footprints (pad centres in the part's own frame; a part is rotated, then mirrored left to right if it is on the bottom)
C0805 = smd 1.3 x 1.5: 1 -0.95,0; 2 0.95,0
C0603 = smd 1.1 x 1: 1 -0.85,0; 2 0.85,0
CHIPLED_0603 = smd 0.8 x 0.8: A 0,-0.75; C 0,0.75
RJ45-DI2C-USB-54602-908LF = drill 1: 24V(6) 1.905,8.89; DSCLM(5) 0.635,6.35; DSCLP(4) -0.635,8.89; DSDAM(2) -3.175,8.89; GND(3) -1.905,6.35; USBM(8) 4.445,8.89; USBP(7) 3.175,6.35 | drill 1 square: DSDAP(1) -4.445,6.35 | hole 3.2: -5.715,0; 5.715,0
RJ12-I2C-A-2004-1-4-LP-N-R = drill 0.8: 1 -8.89,-3.175; 2 -6.35,-1.905; 3 -8.89,-0.635; 4 -6.35,0.635; 5 -8.89,1.905; 6 -6.35,3.175 | hole 3.25: 0,-5.08; 0,5.08
29333C = smd 2.6 x 7.2: 1 -2.3,0; 2 2.3,0
RC0603N = smd 0.756 x 0.8: 1 -0.778,0; 2 0.778,0
SJ1 = smd 1.168 x 1.6: 1 -0.762,0; 2 0.762,0
TP04R = smd 0.4 x 0.4: 1 0,0
TP06R = smd 0.6 x 0.6: TP 0,0
R-78E5.0-1.0 = drill 1 pad 1.676: 1 -2.54,0; 2 0,0; 3 2.54,0
SOP50P490X110-10N = smd 1.4 x 0.3: 1 -2.2,1; 2 -2.2,0.5; 3 -2.2,0; 4 -2.2,-0.5; 5 -2.2,-1; 6 2.2,-1; 7 2.2,-0.5; 8 2.2,0; 9 2.2,0.5; 10 2.2,1
MP04A = smd 1.6 x 0.838: 1 -3.2,2.3; 2 -3.2,0; 3 -3.2,-2.3 | smd 1.6 x 3.099: 4 3.2,0
CORNER = hole 3.81: 0,0

### Placement (x,y rotation side)
C1  43.43,21.34 180 top
C2  47.75,21.34 180 top
C3  51.37,13.97 90 top
C6  41.66,38.86 90 top
C9  51.82,38.86 90 top
D2  51.31,18.54 270 top
D3  25.15,28.45 0 top
D4  52.32,42.93 180 top
J1  13.97,20.32 270 top
J2  73.66,36.83 0 top
J3  13.97,36.83 270 top
J4  73.66,20.32 0 top
L1  45.72,16 90 top
R1  51.31,21.34 0 top
R2  31.5,36.32 90 top
R3  25.15,25.4 270 top
R4  41.66,43.18 270 top
R5  30.73,31.75 180 top
R6  25.4,32.51 90 top
R7  27.69,31.75 180 top
R8  27.69,33.27 0 top
R9  30.73,33.27 0 top
R13  31.5,19.81 90 top
R14  30.73,16.76 0 top
R15  30.73,15.24 180 top
R16  27.69,15.24 180 top
R17  25.4,16 90 top
R19  27.69,16.76 0 top
R20  30.1,26.16 270 top
R21  32.13,26.16 270 top
SJ1  44.45,15.88 90 bottom
TP1  40.13,42.42 0 top
TP2  41.4,36.32 0 top
TP3  48.01,10.79 0 top
TP4  49.28,46.48 0 top
TP5  16.76,10.92 0 top
TP6  53.34,36.32 0 top
TP7  60.39,38.54 0 top
TP8  34.8,22.35 0 top
TP9  34.8,21.59 0 top
TP10  46.23,36.32 0 top
TP11  75.18,46.23 0 top
TP15  60.45,34.04 0 top
TP16  17.78,10.92 0 top
TP17  13.21,10.92 0 top
TP18  35.05,12.45 0 top
TP19  20.57,10.92 0 top
TP20  35.05,13.21 0 top
TP21  16.76,46.23 0 top
TP22  17.78,46.23 0 top
TP23  20.57,46.23 0 top
TP24  13.46,46.23 0 top
TP25  27.43,46.23 0 top
TP26  28.45,46.23 0 top
TP27  53.85,27.24 0 top
TP28  54.1,18.99 0 top
TP29  75.44,10.92 0 top
TP30  60.45,35.05 0 top
U1  46.99,25.4 0 top
U2  27.81,21.84 270 top
U4  47.24,41.15 90 top
U5  27.81,38.35 270 top
U$1  [CORNER]  5.08,5.08 0 top
U$2  [CORNER]  5.08,52.07 270 top
U$3  [CORNER]  80.01,52.07 180 top
U$4  [CORNER]  80.01,5.08 90 top
U$5  [LOGO]  10.16,1.27 0 top
U$6  34.29,1.27 0 top
U$7  10.16,48.26 0 top
U$9  [CAMBRIDGE-MAP-RJ12-ADAPTER-V-1-1]  1.27,1.27 0 top

### Tracks (layer width: path | path; a pad name or v marks a point on that pad's centre or on a via)
24V_EMI
  Top 1.27: U1.1 44.38,25.33 C1.1 44.38,19.64 arc90 L1.2
  Bottom 1.27: U1.1 SJ1.2
+3V3  (via drill 0.35)
  Top 0.305: U2.1 28.85,24 v29.97,24 | v29.97,24 30.1,24.13 R20.2 | U5.1 29.8,40.55 v29.84,40.51 | v29.97,24 31.37,24 32.13,24.77 R21.2
  Top 0.559: TP5.1 v16.76,23.62 v16.76,40.13 TP21.1 16.76,47.45 18.18,48.87 37.49,48.87 39.47,46.89 39.47,42.82 39.88,42.42 TP1.1 41.64,42.42 R4.2 41.66,41.66 42.16,41.15 48.26,41.15 49.54,39.86 U4.3 | TP6.1 58.17,36.32 TP7.1 60.58,38.73 J2.5 64.86,38.65 67.8,38.65 69.57,36.88 69.57,21.54 67.8,19.77 66.53,19.77 65.26,18.5 64.28,18.5 63.59,19.19 63.59,20.18 64.77,21.36 J4.5
  Bottom 0.305: v29.97,24 24.06,24 23.36,24.7 22.36,24.7 21.65,24 21.65,23.95 21.26,23.56 19.38,23.56 19.32,23.62 v16.76,23.62 | v16.76,40.13 19.32,40.13 19.38,40.07 21.26,40.07 21.65,40.46 21.65,40.51 22.36,41.21 23.36,41.21 24.06,40.51 v29.84,40.51
  pour Top (isolate 0.305): 54.61,35.56 54.61,38.61 49.02,38.61 49.02,35.56
+5V  (via drill 0.35)
  Top 0.305: U5.10 29.71,36.15 v29.72,36.14 | R7.2 26.91,31 27.18,30.73 v29.21,30.73 31.24,30.73 31.51,31 R5.1 | U2.10 29.68,19.64 v29.72,19.68 | R16.2 26.91,14.24 27.18,13.97 v29.21,13.97 31.24,13.97 31.51,14.24 R15.1
  Top 0.559: 39.62,37.85 38.61,38.86 38.61,46.53 37.13,48.01 18.54,48.01 17.78,47.24 TP22.1 v17.78,36.07 v17.78,20.95 TP16.1 | TP16.1 17.78,10.67 | TP16.1 17.78,10.5 19.64,8.64 53.85,8.64 55.37,10.16 55.37,26.67 54.1,27.94 53.34,27.94
  Bottom 0.305: v29.21,30.73 29.72,31.24 v29.72,36.14 21.98,36.14 20.82,34.99 19.82,34.99 18.74,36.07 v17.78,36.07 | v17.78,20.95 17.84,20.89 20.82,20.89 22.03,19.68 v29.72,19.68 29.72,14.48 v29.21,13.97
  pour Top (isolate 0.305): 54.61,34.29 54.61,20.32 48.26,20.32 48.26,34.29
  pour Top (isolate 0.305): 39.37,35.56 45.21,35.56 45.21,38.61 39.37,38.61
+24V  (via drill 0.35)
  Top 0.305: 18.92,18.41 18.8,18.29 | 18.8,26.35 22.23,26.35 23.95,24.62 R3.2
  Top 0.406: J1.24V(6) 18.92,18.41 | J3.24V(6) v18.8,34.92
  Top 0.559: 39.62,10.41 38.86,9.65 21.84,9.65 TP19.1 18.8,12.7 v18.8,18.41 | 18.8,18.29 v18.8,18.41 | v18.8,18.41 18.8,26.35 v18.8,34.92 18.8,44.45 TP23.1
  Bottom 0.406: J1.24V(6) v18.8,18.41
  Bottom 1.27: SJ1.1 42.74,15.11 v41.27,13.65
  pour Top (isolate 0.406): 54.61,13.97 54.61,10.16 39.37,10.16 39.37,13.97
DSCLM_1
  Top 0.305: R17.2 25.42,16.76 R19.1 26.81,16.8 U2.6 20.36,19.64 J1.DSCLM(5)
DSCLM_2
  Top 0.305: U5.6 26.81,36.69 | U5.6 20.32,36.15 J3.DSCLM(5) | U5.6 26.81,33.37 R8.1 25.42,33.27 R6.2
DSCLP_1
  Top 0.305: J1.DSCLP(4) 27.05,20.95 27.31,20.69 U2.7 27.31,17.91 R19.2 R16.1
DSCLP_2
  Top 0.305: J3.DSCLP(4) 27.05,37.47 27.31,37.2 U5.7 27.31,34.41 28.45,33.27 R8.2 R7.1
DSDAM_1
  Top 0.305: U2.9 28.32,19.65 | U2.9 28.31,21.22 26.04,23.5 J1.DSDAM(2) | R14.2 31.51,18.29 | 31.51,18.29 31.51,18.76 R13.1 | U2.9 28.31,18.68 28.7,18.29 31.51,18.29
DSDAM_2
  Top 0.305: J3.DSDAM(2) 26.04,40.01 28.31,37.73 U5.9 28.31,34.93 28.45,34.8 31.5,34.8 | R2.1 31.5,34.8 | 31.5,34.8 31.5,33.29 R9.2
DSDAP_1
  Top 0.305: J1.DSDAP(1) 20.32,24.13 22.23,22.23 26.54,22.23 27.81,20.95 U2.8 27.81,18.41 28.61,17.62 29.62,17.62 29.96,17.29 R14.1 | R14.1 R15.2 | 29.89,16.76 R14.1
DSDAP_3
  Top 0.305: J3.DSDAP(1) 20.32,40.44 21.96,38.8 26.48,38.8 27.81,37.47 U5.8 27.81,34.67 28.19,34.29 29.46,34.29 29.96,33.8 R9.1 R5.2
GND  (via drill 0.35)
  Top 0.305: U5.5 26.81,41.51 v26.16,42.16 | v26.48,27.3 26.81,26.97 U2.5
  other vias: 46.74,47.5 62.99,9.65 25.15,6.6 7.87,20.07 62.48,44.7 64.52,26.16 33.27,16.76 71.37,28.7 55.37,32.26 50.29,17.02 41.15,19.81 44.7,44.45 44.7,43.69 43.94,44.45 43.94,43.69 43.18,43.69 43.18,44.45 44.7,45.21 43.18,45.21 43.94,45.21 49.53,43.69 50.29,43.69 51.05,43.69 49.53,44.45 49.53,45.21 50.29,44.45 50.29,45.21 51.05,45.21 51.05,44.45 46.74,39.88 52.83,41.15 47.75,39.88 11.94,28.7 40.89,41.15 78.23,20.32 78.49,37.08 7.87,36.58 22.1,28.45 11.94,45.21 29.97,37.34 25.91,13.97 46.23,26.92 46.23,27.69 45.47,27.69 45.47,26.92 46.23,28.45 45.47,28.45 31.75,43.94 33.02,41.4 32.51,23.37 20.57,13.97 52.58,17.02
  pour Top (isolate 0.406, rank 3): 39.37,46.99 39.37,35.56 54.61,35.56 54.61,46.99
  pour Top (isolate 0.305, rank 3): 0,0 85.09,0 85.09,57.15 0,57.15
  pour Top (isolate 0.305): 1.27,10.16 35.56,10.16 35.56,46.99 1.27,46.99
  pour Bottom (isolate 0.406): 35.56,10.16 35.56,46.99 1.27,46.99 1.27,10.16
  pour Bottom (isolate 0.305, rank 3): 0,0 85.09,0 85.09,57.15 0,57.15
  pour Top (isolate 0.305): 83.82,46.99 83.82,10.16 59.69,10.16 59.69,46.99
  pour Top (isolate 0.305, rank 2): 54.61,34.29 54.61,10.16 39.37,10.16 39.37,34.29
  pour Bottom (isolate 0.406, rank 2): 39.37,34.29 39.37,10.16 54.61,10.16 54.61,34.29
  pour Bottom (isolate 0.406): 39.37,46.99 54.61,46.99 54.61,35.56 39.37,35.56
N$5
  Top 0.305: D4.A 50.53,41.88 43.6,41.88 41.66,43.83 R4.1
N$6
  Top 0.559: R1.1 50.53,18.57 D2.A
N$7
  Top 0.305: R3.1 D3.A
SCL  (via drill 0.35)
  Top 0.305: 27.31,28.58 U2.4 27.31,23.08 28.8,21.59 TP9.1 37.34,21.59 38.61,22.86 38.61,32.92 39.73,34.04 TP15.1 62.61,36.2 J2.3 66.04,34.92 66.04,20.95 J4.3 | 31.75,30.23 31.5,29.97 28.7,29.97 27.31,28.58 | TP25.1 27.31,46.11 U5.4 27.31,39.59 28.55,38.35 31.75,38.35 32.51,37.59 32.51,30.99 31.75,30.23 | 27.31,28.58 26.68,28.58 v26.67,28.57 | v31.43,28.57 32.13,27.88 R21.1 | 31.75,30.23
  Bottom 0.305: v26.67,28.57 v31.43,28.57
SDA
  Top 0.305: 28.31,26.92 U2.2 28.31,23 28.96,22.35 TP8.1 37.24,22.35 38,23.11 38,33.17 39.62,34.8 60.2,34.8 TP30.1 62.87,37.47 J2.4 68.83,35.94 68.83,22.48 J4.4 | R20.1 28.33,26.94 28.31,26.92 | 28.31,26.92 28.31,28.72 28.96,29.36 31.75,29.36 33.12,30.73 33.12,37.84 32,38.96 28.8,38.96 28.31,39.45 U5.2 28.31,46.09 TP26.1
USBM
  Top 0.305: J1.USBM(8) 25.53,13.21 TP20.1
  Bottom 0.305: 22.86,31.65 J3.USBM(8) 16.1,25.63 16.1,25.15 15.39,24.44 15.39,17.78 17.24,15.94 22.8,15.94 J1.USBM(8)
USBP  (via drill 0.35)
  Top 0.305: J1.USBP(7) 20.32,16.51 24.38,12.45 TP18.1 | J3.USBP(7) v20.32,28.45
  Bottom 0.305: v20.32,28.45 16,24.13 16,18.54 17.4,17.14 J1.USBP(7)

### Text on the board
tPlace: Enables devices on RJ12-I2C comm / system to interface with RJ45-dI2C-USB / comm system. Converts 24V & dI2C on / RJ45 to 3V3 & I2C on RJ12. | GND | 3V3 | 5V | 24V | SCL | SDA | GND | GND | 3.3V | GND | 3V3 | 5V | GND | 3.3V | 5V to 3.3V@400mA / Linear Regulator w/ LED | NC | SDA | SCL | 5V | EDGE | EDGE | GND | SDA | SCL | GND | USBM | GND | 3V3 | 5V | 24V | NC | USBP | RJ45 Connector Pair w/dI2C Buffer + Indicator LED | 24V | 24V to 5V@1A Switching Regulator / w/Optional EMI Filter + Indicator LED | RJ12-I2C Connector Pair | GND
bPlace: EMI / Bypass